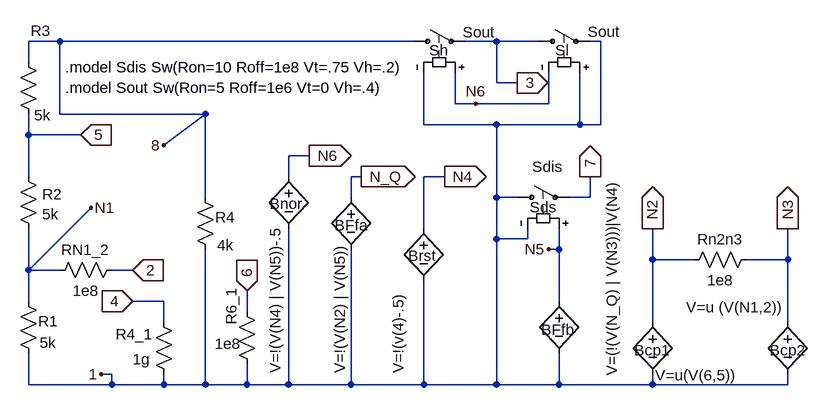
[diagram p0: schematic Lt555BdMin.asc]
Lt555BdMin.asc, the LTspice schematic file:
Version 4
SHEET 1 1152 916
WIRE -576 128 -576 96
WIRE -576 240 -576 208
WIRE -576 304 -576 240
WIRE -576 448 -576 384
WIRE -576 496 -576 448
WIRE -576 624 -576 576
WIRE -528 96 -576 96
WIRE -528 208 -528 96
WIRE -528 448 -576 448
WIRE -496 240 -576 240
WIRE -480 352 -576 448
WIRE -448 608 -464 608
WIRE -448 624 -576 624
WIRE -448 624 -448 608
WIRE -416 448 -448 448
WIRE -368 496 -416 496
WIRE -368 528 -368 496
WIRE -368 624 -448 624
WIRE -368 624 -368 608
WIRE -304 208 -528 208
WIRE -304 208 -368 256
WIRE -304 336 -304 208
WIRE -304 624 -368 624
WIRE -304 624 -304 416
WIRE -240 512 -240 480
WIRE -240 624 -304 624
WIRE -240 624 -240 592
WIRE -176 304 -176 272
WIRE -176 624 -240 624
WIRE -176 624 -176 384
WIRE -144 272 -176 272
WIRE -80 336 -80 304
WIRE -80 624 -176 624
WIRE -80 624 -80 416
WIRE -64 304 -80 304
WIRE 16 96 -528 96
WIRE 32 224 32 144
WIRE 32 384 32 304
WIRE 32 624 -80 624
WIRE 32 624 32 464
WIRE 64 304 32 304
WIRE 80 192 80 144
WIRE 112 192 80 192
WIRE 144 96 96 96
WIRE 144 160 144 96
WIRE 144 224 32 224
WIRE 144 336 144 224
WIRE 144 400 144 336
WIRE 144 624 32 624
WIRE 144 624 144 400
WIRE 176 160 144 160
WIRE 176 336 144 336
WIRE 192 400 144 400
WIRE 192 400 192 384
WIRE 208 96 144 96
WIRE 224 192 112 192
WIRE 224 192 224 144
WIRE 240 416 224 416
WIRE 240 416 240 384
WIRE 240 496 240 416
WIRE 240 624 144 624
WIRE 240 624 240 576
WIRE 272 224 144 224
WIRE 272 224 272 144
WIRE 288 336 256 336
WIRE 288 336 288 304
WIRE 304 96 288 96
WIRE 304 224 272 224
WIRE 304 224 304 96
WIRE 384 432 384 384
WIRE 384 528 384 432
WIRE 384 624 240 624
WIRE 384 624 384 608
WIRE 448 432 384 432
WIRE 592 432 528 432
WIRE 592 432 592 384
WIRE 592 528 592 432
WIRE 592 624 384 624
WIRE 592 624 592 608
FLAG -480 352 N1
FLAG -496 240 5
IOPIN -496 240 In
FLAG 288 304 7
IOPIN 288 304 Out
FLAG 224 416 N5
FLAG -368 256 8
FLAG 176 160 3
IOPIN 176 160 Out
FLAG 112 192 N6
FLAG -464 608 1
FLAG -416 496 4
IOPIN -416 496 In
FLAG -240 480 6
IOPIN -240 480 In
FLAG 384 384 N2
IOPIN 384 384 Out
FLAG -416 448 2
IOPIN -416 448 In
FLAG 592 384 N3
IOPIN 592 384 Out
FLAG -144 272 N6
IOPIN -144 272 Out
FLAG -64 304 N_Q
IOPIN -64 304 Out
FLAG 64 304 N4
IOPIN 64 304 Out
SYMBOL res -592 480 R0
WINDOW 0 31 47 Left 0
WINDOW 3 33 80 Left 0
SYMATTR InstName R1
SYMATTR Value 5k
SYMBOL res -592 288 R0
WINDOW 0 37 43 Left 0
WINDOW 3 37 74 Left 0
SYMATTR InstName R2
SYMATTR Value 5k
SYMBOL res -592 112 R0
WINDOW 0 19 -32 Left 0
WINDOW 3 25 98 Left 0
SYMATTR InstName R3
SYMATTR Value 5k
SYMBOL sw 160 336 R270
WINDOW 0 -15 35 VRight 0
WINDOW 3 47 39 VRight 0
SYMATTR InstName Sds
SYMATTR Value Sdis
SYMBOL sw 0 96 R270
WINDOW 0 -14 40 VRight 0
WINDOW 3 14 92 VRight 0
SYMATTR InstName Sh
SYMATTR Value Sout
SYMBOL sw 192 96 R270
WINDOW 0 -14 42 VRight 0
WINDOW 3 15 92 VRight 0
SYMATTR InstName Sl
SYMATTR Value Sout
SYMBOL res -320 320 R0
WINDOW 0 31 47 Left 0
WINDOW 3 34 90 Left 0
SYMATTR InstName R4
SYMATTR Value 4k
SYMBOL res 432 448 R270
WINDOW 0 32 56 VTop 0
WINDOW 3 0 56 VBottom 0
SYMATTR InstName Rn2n3
SYMATTR Value 1e8
SYMBOL res -544 464 R270
WINDOW 0 32 56 VTop 0
WINDOW 3 0 56 VBottom 0
SYMATTR InstName RN1_2
SYMATTR Value 1e8
SYMBOL bv 384 512 R0
WINDOW 0 -28 59 Left 0
WINDOW 3 130 98 Right 0
SYMATTR InstName Bcp1
SYMATTR Value V=u(V(6,5))
SYMBOL bv 592 512 R0
WINDOW 0 -28 59 Left 0
WINDOW 3 -156 -7 Left 0
SYMATTR InstName Bcp2
SYMATTR Value V=u (V(N1,2))
SYMBOL bv -176 288 R0
WINDOW 0 -29 58 Left 0
WINDOW 3 -20 92 VRight 0
SYMATTR InstName Bnor
SYMATTR Value V=!(V(N4) | V(N5))-.5
SYMBOL bv -80 320 R0
WINDOW 0 -25 59 Left 0
WINDOW 3 -17 88 VRight 0
SYMATTR InstName BFfa
SYMATTR Value V=!(V(N2) | V(N5))
SYMBOL bv 32 368 R0
WINDOW 0 -24 58 Left 0
WINDOW 3 -39 239 VLeft 0
SYMATTR InstName Brst
SYMATTR Value V=!(v(4)-.5)
SYMBOL res -256 496 R0
WINDOW 0 -8 -22 VRight 0
WINDOW 3 -34 65 Left 0
SYMATTR InstName R6_1
SYMATTR Value 1e8
SYMBOL bv 240 480 R0
WINDOW 0 -27 60 Left 0
WINDOW 3 81 131 VLeft 0
SYMATTR InstName BFfb
SYMATTR Value V=(!(V(N_Q) | V(N3)))|V(N4)
SYMBOL res -384 512 R0
WINDOW 0 -58 35 Left 0
WINDOW 3 -32 73 Left 0
SYMATTR InstName R4_1
SYMATTR Value 1g
TEXT -520 136 Left 0 !.model Sdis Sw(Ron=10 Roff=1e8 Vt=.75 Vh=.2)\n.model Sout Sw(Ron=5 Roff=1e6 Vt=0 Vh=.4)

The netlist it stands for:
* Lt555BdMin.asc
R1 N1 1 5k
R2 5 N1 5k
R3 8 5 5k
Sds 1 7 N5 1 Sdis
Sh 8 3 N6 1 Sout
Sl 3 1 1 N6 Sout
R4 8 1 4k
Rn2n3 N2 N3 1e8
RN1_2 N1 2 1e8
Bcp1 N2 1 V=u(V(6,5))
Bcp2 N3 1 V=u (V(N1,2))
Bnor N6 1 V=!(V(N4) | V(N5))-.5
BFfa N_Q 1 V=!(V(N2) | V(N5))
Brst N4 1 V=!(v(4)-.5)
R6_1 6 1 1e8
BFfb N5 1 V=(!(V(N_Q) | V(N3)))|V(N4)
R4_1 4 1 1g
.model Sdis Sw(Ron=10 Roff=1e8 Vt=.75 Vh=.2)
.model Sout Sw(Ron=5 Roff=1e6 Vt=0 Vh=.4)
.backanno
.end